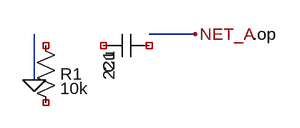
[diagram p0: schematic case_01.asc]
case_01.asc, the LTspice schematic file:
Version 4.1
SHEET 1 880 680
WIRE 160 96 160 160
WIRE 320 96 384 96
FLAG 160 160 0
FLAG 384 96 NET_A
SYMBOL res 160 96 R0
WINDOW 0 36 56 Left 2
SYMATTR InstName R1
SYMATTR Value 10k
SYMATTR SpiceLine tc=0.01
SYMBOL cap 320 96 R90
WINDOW 0 24 56 Left 2
SYMATTR InstName C1
SYMATTR Value 22u
SYMATTR Type cap
TEXT 464 96 Left 2 !.op

The netlist it stands for:
* case_01.asc
R1 NC_01 NC_02 10k tc=0.01
C1 NC_03 NC_04 22u
.op
.backanno
.end